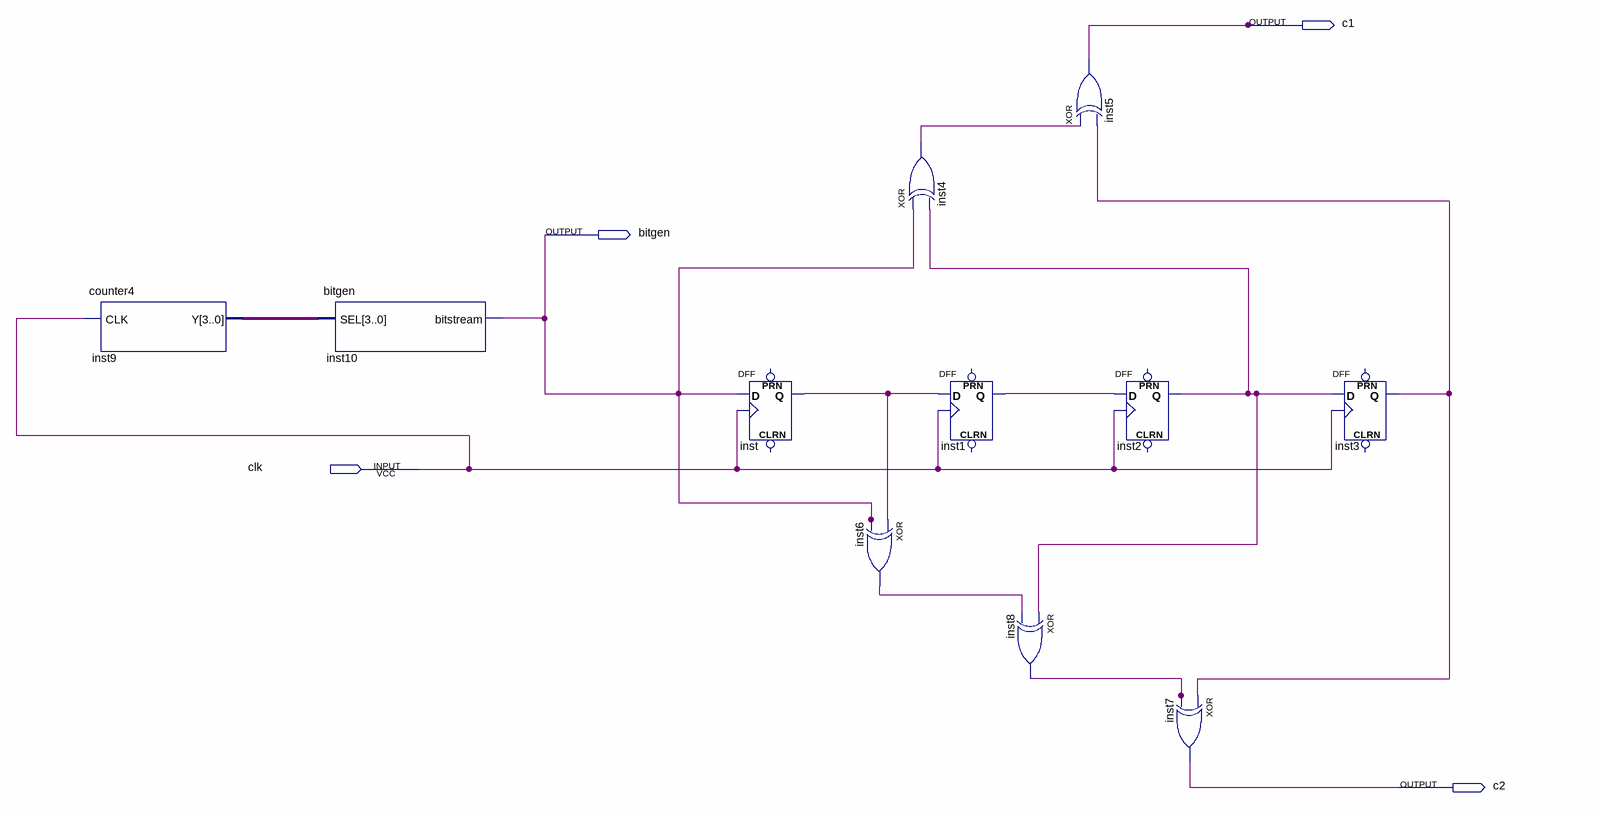
[diagram p0: schematic sheet]
// Quartus schematic conv_encoder_G23_G33.bdf as structural Verilog: 11 symbols, 4 pins
module conv_encoder_G23_G33 (
  input  clk,
  output c1,
  output bitgen,
  output c2
);

  wire inst1_q, inst2_q, inst3_q, inst4_out, inst6_out, inst8_out, inst_q;
  wire [3:0] inst9_y;

  counter4 inst9 (.CLK(clk), .Y(inst9_y));
  bitgen inst10 (.SEL(inst9_y), .bitstream(bitgen));
  DFF inst (.CLK(clk), .D(bitgen), .Q(inst_q));  // open: CLRN, PRN
  xor inst6 (inst6_out, inst_q, bitgen);
  xor inst4 (inst4_out, bitgen, inst2_q);
  DFF inst1 (.CLK(clk), .D(inst_q), .Q(inst1_q));  // open: CLRN, PRN
  xor inst8 (inst8_out, inst2_q, inst6_out);
  xor inst5 (c1, inst4_out, inst3_q);
  DFF inst2 (.CLK(clk), .D(inst1_q), .Q(inst2_q));  // open: CLRN, PRN
  xor inst7 (c2, inst3_q, inst8_out);
  DFF inst3 (.CLK(clk), .D(inst2_q), .Q(inst3_q));  // open: CLRN, PRN
endmodule
